# EAGLE design OLED-Pi EH (EAGLE 9.6.2)
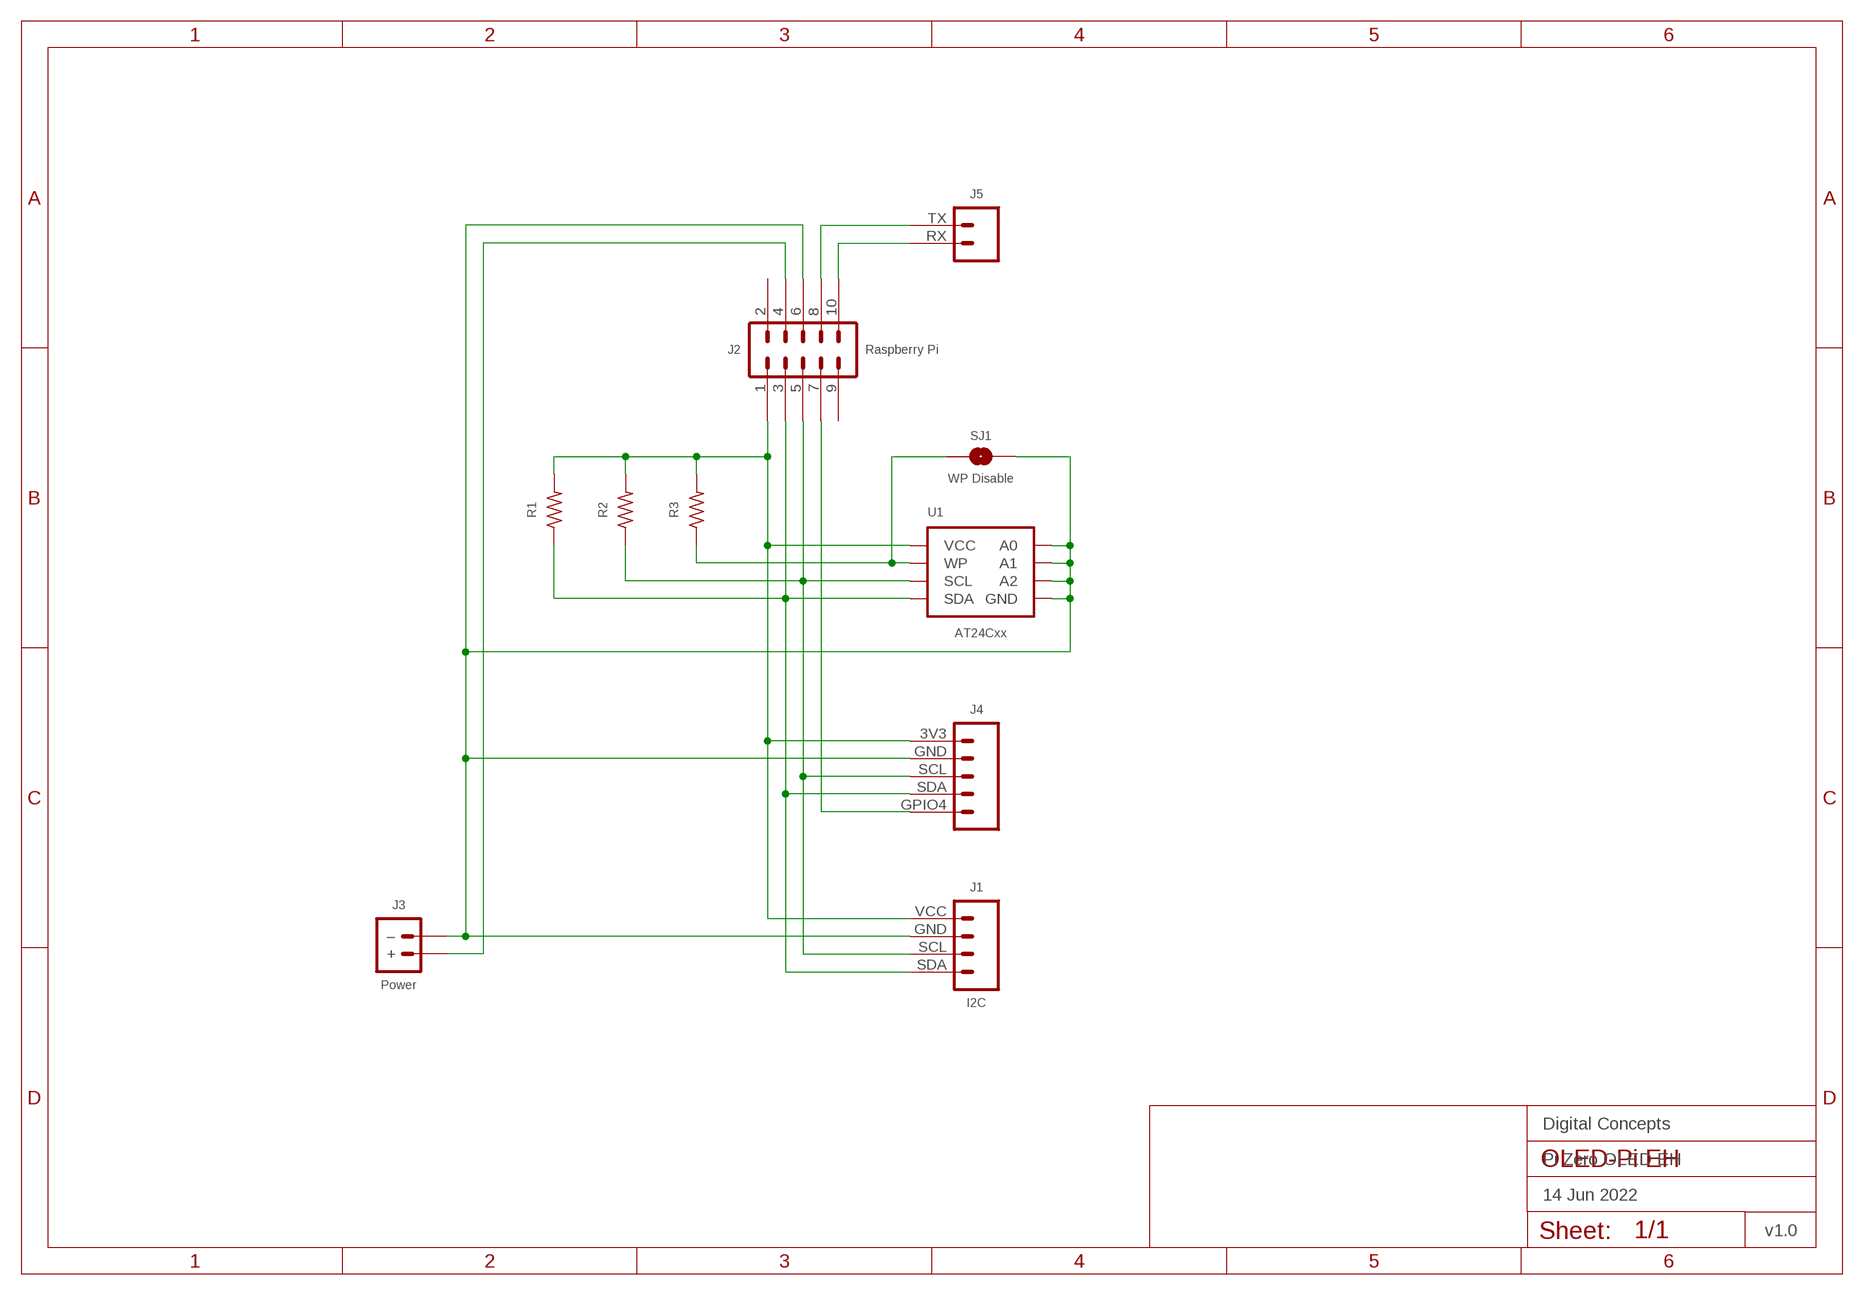
[diagram p0: schematic, sheet 1]
FRAME1 (FRAME-A4L-LOC): DATE: 14 Jun 2022; OWNER: Digital Concepts; TITLE: Pi Zero OLED EH; VERSION: v1.0

## Parts
J1  I2C  HEADER-1X4-I2C  [CONN_04-I2C]
J2  Raspberry Pi  HEADER-2X5-PI-1  [CONN_2X5-PI-1]
J3  Power  JST-PH2.0-2-HORIZONTAL-POWERJST-PTH-2  [JST-PH2.0-2-HORIZONTAL-POWER]
J4  JST-PH2.0-5-HORIZONTAL-OLED-PI  [JST-PH2.0-5-HORIZONTAL-OLED-PI]
J5  JST-PH2.0-2-HORIZONTAL-TX-RXJST-PTH-2  [JST-PH2.0-2-HORIZONTAL=TX-RX]
R1  RESISTORR0805  [R0805]
R2  RESISTORR0805  [R0805]
R3  RESISTORR0805  [R0805]
SJ1  WP Disable  SJ  [SJ]
U1  AT24Cxx  AT24CXX-EEPROM  [SOP-8]

## Nets
GND: J1.GND J2.6 J3.-(–) J4.GND SJ1.2 U1.P$1(A0) U1.P$2(A1) U1.P$3(A2) U1.P$4(GND)
N$2: J2.4 J3.+
N$4: J1.SDA J2.3 J4.SDA R1.1 U1.P$5(SDA)
N$5: J1.SCL J2.5 J4.SCL R2.1 U1.P$6(SCL)
N$6: J2.7 J4.GPIO4
N$7: J2.10 J5.RX
N$8: J2.8 J5.TX
N$9: R3.1 SJ1.1 U1.P$7(WP)
VCC: J1.VCC J2.1 J4.3V3 R1.2 R2.2 R3.2 U1.P$8(VCC)
Unconnected: J2.2 J2.9

## Library data of the parts
J1 = digitalconcepts:HEADER-1X4-I2C: I2C Interface [Pin 1 Vcc] 4-Pin Header
J2 = digitalconcepts:HEADER-2X5-PI-1: Ras-Pi 2x5 PTH Header Rapsberry Pi, starting at Pin 1
J3 = digitalconcepts:JST-PH2.0-2-HORIZONTAL-POWER: PH2.0 2P Right Angle PCB Connector; PROD_ID: CONN-09863; SKU: PRT-09914
J4 = digitalconcepts:JST-PH2.0-5-HORIZONTAL-OLED-PI: PH2.0 5P OLED-Pi Horizontal Connector
J5 = digitalconcepts:JST-PH2.0-2-HORIZONTAL-TX-RX: PH2.0 2P Right Angle PCB Connector with Tx/Rx Pin Labels; PROD_ID: CONN-09863; SKU: PRT-09914
R1-R3 = digitalconcepts:RESISTOR: Resistor; SPICEPREFIX: R
SJ1 = digitalconcepts:SJ: Solder Jumper
U1 = digitalconcepts:AT24CXX-EEPROM: AT24Cxx EEPROM SOP-8

## Board
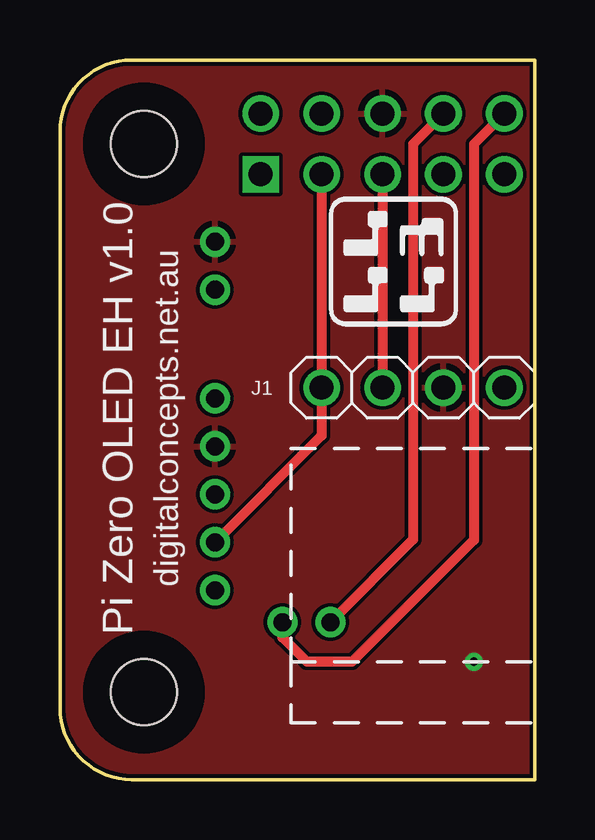
[diagram p1: board, top side]
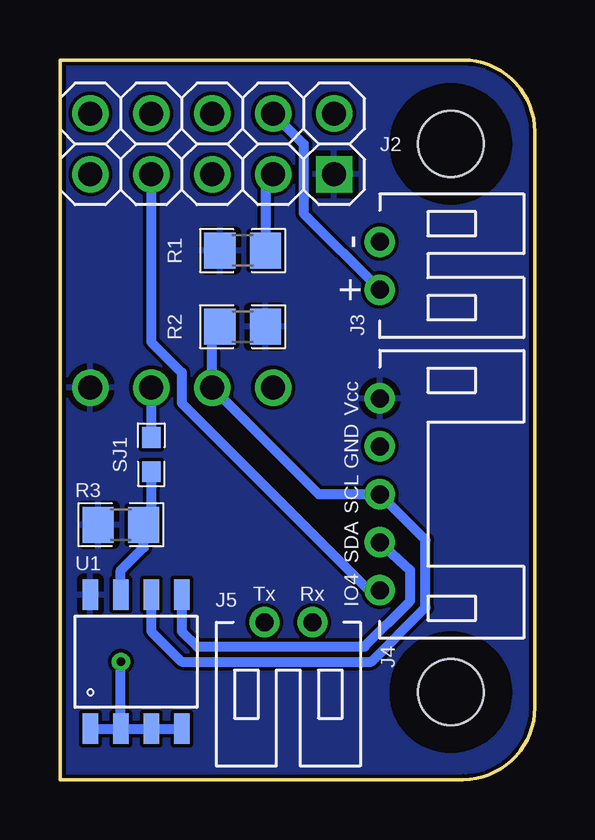
[diagram p2: board, bottom side, seen from below]

Size 19.8 x 30 mm. Coordinates in mm from the lower left corner, seen from the top.
Outline: 19.8,30 19.8,0 2.99,0 arc-90 0,2.99 0,27.01 arc-90 2.99,30 19.8,30
Copper layers (1*16): Top 0.035mm / dielectric 1.5mm / Bottom 0.035mm
Design rules "default *": minimum track width 6mil, minimum drill 0.35mm, track to track 6mil, track to pad 6mil, pad to pad 6mil, via to via 6mil, smd to smd 6mil, copper to edge 6mil, drill to drill 6mil, minimum pad ring 10mil, minimum via ring 8mil, stop-mask expansion 4mil, vias tented up to drill 0mil, thermal gap 10mil
Holes 2.75 mm at 3.5,26.5 3.5,3.64

### Footprints (pad centres in the part's own frame; a part is rotated, then mirrored left to right if it is on the bottom)
CONN_04-I2C = drill 1 pad 1.524: GND 2.54,0; SCL 5.08,0; SDA 7.62,0; VCC 0,0
CONN_2X5-PI-1 = drill 1 pad 1.524 square: 1 0,0 | drill 1 pad 1.524: 2 0,2.54; 3 2.54,0; 4 2.54,2.54; 5 5.08,0; 6 5.08,2.54; 7 7.62,0; 8 7.62,2.54; 9 10.16,0; 10 10.16,2.54
JST-PH2.0-2-HORIZONTAL-POWER = drill 0.75: + 1,0; - -1,0
JST-PH2.0-5-HORIZONTAL-OLED-PI = drill 0.75: 3V3 4,0; GND 2,0; GPIO4 -4,0; SCL 0,0; SDA -2,0
JST-PH2.0-2-HORIZONTAL=TX-RX = drill 0.75: RX -1,0; TX 1,0
R0805 = smd 1.3 x 1.5: 1 -0.95,0; 2 0.95,0
SJ = smd 0.864 x 0.762: 1 -0.711,0; 2 0.711,0
SOP-8 = smd 0.635 x 1.27: P$1 -1.905,-2.794; P$2 -0.635,-2.794; P$3 0.635,-2.794; P$4 1.905,-2.794; P$5 1.905,2.794; P$6 0.635,2.794; P$7 -0.635,2.794; P$8 -1.905,2.794

### Placement (x,y rotation side)
J1  18.53,16.34 180 top
J2  8.37,25.23 0 top
J3  6.47,21.42 270 bottom
J4  6.47,11.89 90 bottom
J5  10.28,6.56 180 bottom
R1  12.18,22.05 180 bottom
R2  12.18,18.88 0 bottom
R3  17.26,10.62 180 bottom
SJ1  15.99,13.55 90 bottom
U1  16.63,4.91 0 bottom

### Tracks (layer width: path | path; a pad name or v marks a point on that pad's centre or on a via)
$X1
  cutout Top: 3.5,6.18 arc180 3.5,1.1 arc180
$X2
  cutout Top: 3.5,29.04 arc180 3.5,23.96 arc180
$X3
  cutout Bottom: 3.5,6.18 arc180 3.5,1.1 arc180
$X4
  cutout Bottom: 3.5,29.04 arc180 3.5,23.96 arc180
GND  (via drill 0.35)
  Bottom 0.406: U1.P$4 U1.P$3 U1.P$2 | U1.P$1 U1.P$2 | J1.GND SJ1.2 | U1.P$2 v17.26,4.91
  pour Top: 21.07,31.58 -1.15,31.58 -1.15,-1.44 21.07,-1.44
N$2
  Bottom 0.406: J2.4 9.64,26.5 9.64,23.59 J3.+
N$4
  Top 0.406: J2.3 J1.SDA 10.91,14.34 J4.SDA
  Bottom 0.406: U1.P$5 14.72,6.18 14.09,5.54 7.1,5.54 5.2,7.45 5.2,8.72 J4.SDA | J2.3 11.23,24.91 R1.1
N$5
  Top 0.406: J2.5 J1.SCL
  Bottom 0.406: U1.P$6 15.99,6.18 14.72,4.91 6.82,4.91 4.56,7.17 4.56,9.99 J4.SCL 9.01,11.89 J1.SCL 13.45,18.56 R2.1
N$6
  Bottom 0.406: J4.GPIO4 6.91,7.89 14.72,15.7 14.72,16.97 15.99,18.24 J2.7
N$7
  Top 0.406: J2.10 17.26,26.5 17.26,9.99 12.18,4.91 10.29,4.91 9.28,5.93 J5.RX
N$8
  Top 0.406: J2.8 14.72,26.5 14.72,10.01 J5.TX
N$9
  Bottom 0.406: U1.P$7 17.26,8.72 16.31,9.67 R3.1 15.99,10.94 SJ1.1
VCC
  pour Bottom: 20.44,30.94 -0.52,30.94 -0.52,-0.81 20.44,-0.81

### Text on the board
tPlace: Pi Zero OLED EH v1.0 | digitalconcepts.net.au
bNames: Vcc | GND | SCL | SDA | IO4 | Rx | Tx
tValues: SDA | SCL | GND | VCC
bValues: 5V